# EAGLE design scaler_dual (EAGLE 5.06)
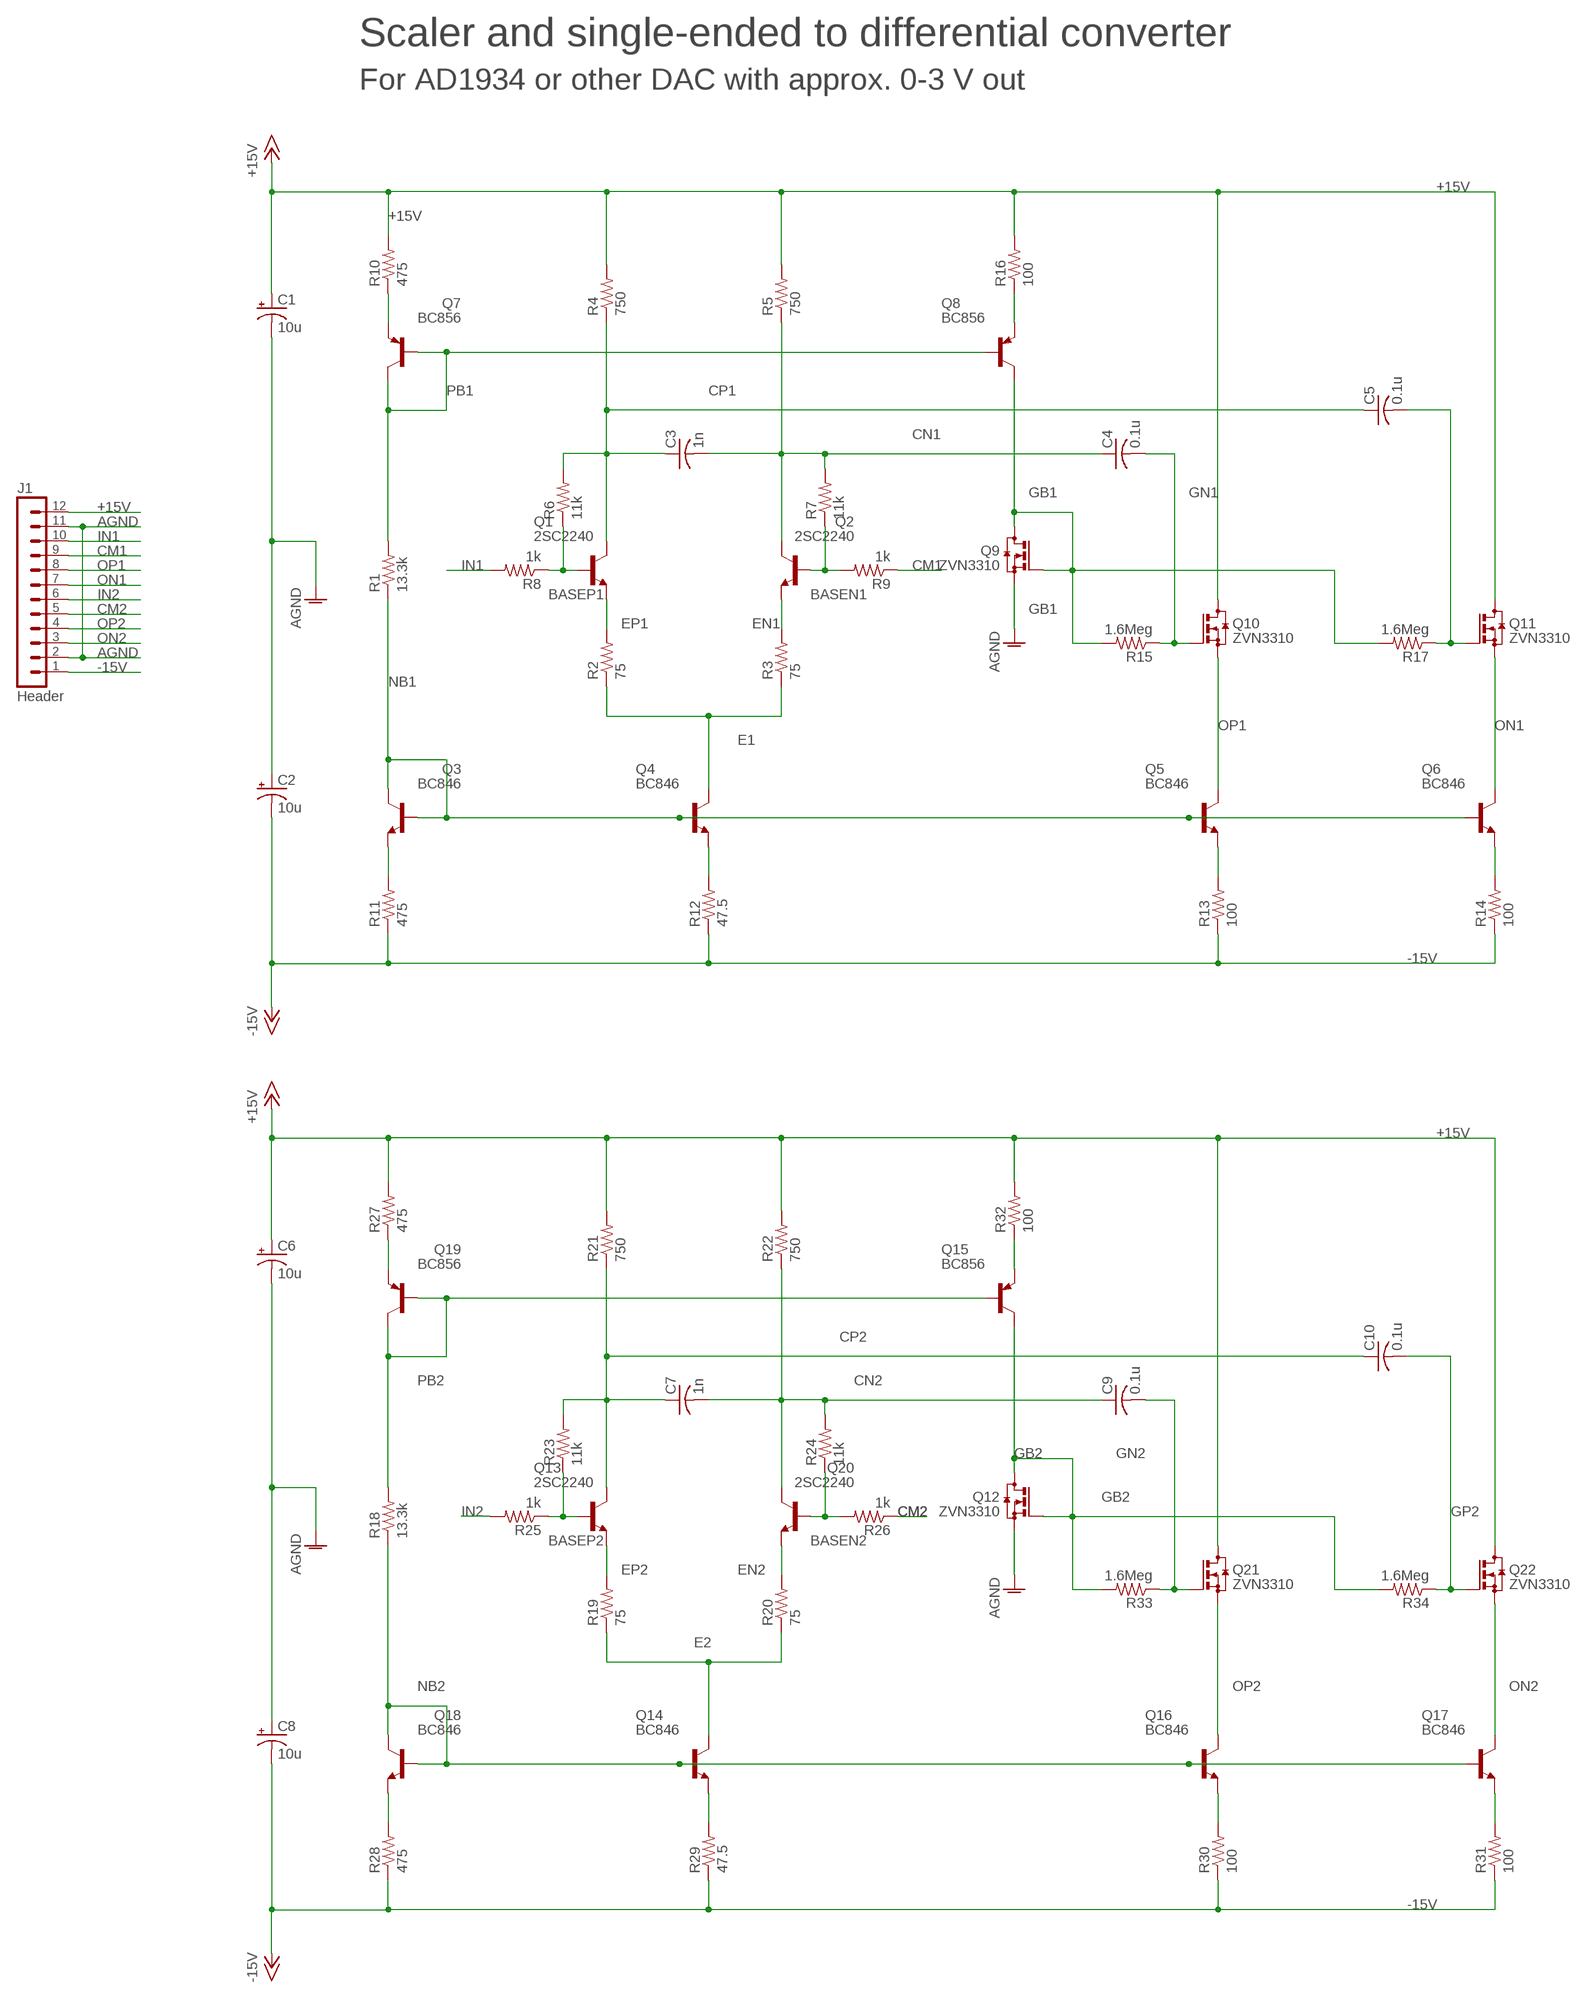
[diagram p0: schematic, sheet 1]

## Parts
C1  10u  CPOL-USC/6032-28R  [C/6032-28R]
C2  10u  CPOL-USC/6032-28R  [C/6032-28R]
C3  1n  C-USC1206  [C1206]
C4  0.1u  C-USC1812  [C1812]
C5  0.1u  C-USC1812  [C1812]
C6  10u  CPOL-USC/6032-28R  [C/6032-28R]
C7  1n  C-USC1206  [C1206]
C8  10u  CPOL-USC/6032-28R  [C/6032-28R]
C9  0.1u  C-USC1812  [C1812]
C10  0.1u  C-USC1812  [C1812]
J1  Header  MA12-1  [MA12-1]
Q1  2SC2240  [TO92-ECB]
Q2  2SC2240  [TO92-ECB]
Q3  BC846  [SOT23]
Q4  BC846  [SOT23]
Q5  BC846  [SOT23]
Q6  BC846  [SOT23]
Q7  BC856  BC856BSMD  [SOT23-BEC]
Q8  BC856  BC856BSMD  [SOT23-BEC]
Q9  ZVN3310  BSS123  [SOT23]
Q10  ZVN3310  BSS123  [SOT23]
Q11  ZVN3310  BSS123  [SOT23]
Q12  ZVN3310  BSS123  [SOT23]
Q13  2SC2240  [TO92-ECB]
Q14  BC846  [SOT23]
Q15  BC856  BC856BSMD  [SOT23-BEC]
Q16  BC846  [SOT23]
Q17  BC846  [SOT23]
Q18  BC846  [SOT23]
Q19  BC856  BC856BSMD  [SOT23-BEC]
Q20  2SC2240  [TO92-ECB]
Q21  ZVN3310  BSS123  [SOT23]
Q22  ZVN3310  BSS123  [SOT23]
R1  13.3k  R-US_R1206  [R1206]
R2  75  R-US_R1206  [R1206]
R3  75  R-US_R1206  [R1206]
R4  750  R-US_R1206  [R1206]
R5  750  R-US_R1206  [R1206]
R6  11k  R-US_R1206  [R1206]
R7  11k  R-US_R1206  [R1206]
R8  1k  R-US_R1206  [R1206]
R9  1k  R-US_R1206  [R1206]
R10  475  R-US_R1206  [R1206]
R11  475  R-US_R1206  [R1206]
R12  47.5  R-US_R1206  [R1206]
R13  100  R-US_R1206  [R1206]
R14  100  R-US_R1206  [R1206]
R15  1.6Meg  R-US_R1206  [R1206]
R16  100  R-US_R1206  [R1206]
R17  1.6Meg  R-US_R1206  [R1206]
R18  13.3k  R-US_R1206  [R1206]
R19  75  R-US_R1206  [R1206]
R20  75  R-US_R1206  [R1206]
R21  750  R-US_R1206  [R1206]
R22  750  R-US_R1206  [R1206]
R23  11k  R-US_R1206  [R1206]
R24  11k  R-US_R1206  [R1206]
R25  1k  R-US_R1206  [R1206]
R26  1k  R-US_R1206  [R1206]
R27  475  R-US_R1206  [R1206]
R28  475  R-US_R1206  [R1206]
R29  47.5  R-US_R1206  [R1206]
R30  100  R-US_R1206  [R1206]
R31  100  R-US_R1206  [R1206]
R32  100  R-US_R1206  [R1206]
R33  1.6Meg  R-US_R1206  [R1206]
R34  1.6Meg  R-US_R1206  [R1206]

## Nets
+15V: C1.+ C6.+ J1.12 Q10.3(D) Q11.3(D) Q21.3(D) Q22.3(D) R4.2 R5.2 R10.2 R16.2 R21.2 R22.2 R27.2 R32.2
-15V: C2.- C8.- J1.1 R11.1 R12.1 R13.1 R14.1 R28.1 R29.1 R30.1 R31.1
AGND: C1.- C2.+ C6.- C8.+ J1.2 J1.11 Q9.2(S) Q12.2(S)
BASEN1: Q2.B R7.1 R9.2
BASEN2: Q20.B R24.1 R26.2
BASEP1: Q1.B R6.1 R8.1
BASEP2: Q13.B R23.1 R25.1
BEA1: Q3.2(E) R11.2
BEA2: Q18.2(E) R28.2
BEB1: Q4.2(E) R12.2
BEB2: Q14.2(E) R29.2
BEC1: Q5.2(E) R13.2
BEC2: Q16.2(E) R30.2
BED1: Q6.2(E) R14.2
BED2: Q17.2(E) R31.2
BEE1: Q7.E R10.1
BEE2: Q19.E R27.1
BEF1: Q8.E R16.1
BEF2: Q15.E R32.1
CM1: J1.9 R9.1
CM2: J1.5 R26.1
CN1: C3.2 C4.1 Q2.C R5.1 R7.2
CN2: C7.2 C9.1 Q20.C R22.1 R24.2
CP1: C3.1 C5.1 Q1.C R4.1 R6.2
CP2: C7.1 C10.1 Q13.C R21.1 R23.2
E1: Q4.3(C) R2.1 R3.1
E2: Q14.3(C) R19.1 R20.1
EN1: Q2.E R3.2
EN2: Q20.E R20.2
EP1: Q1.E R2.2
EP2: Q13.E R19.2
GB1: Q8.C Q9.1(G) Q9.3(D) R15.2 R17.2
GB2: Q12.1(G) Q12.3(D) Q15.C R33.2 R34.2
GN1: C4.2 Q10.1(G) R15.1
GN2: C9.2 Q21.1(G) R33.1
GP1: C5.2 Q11.1(G) R17.1
GP2: C10.2 Q22.1(G) R34.1
IN1: J1.10 R8.2
IN2: J1.6 R25.2
NB1: Q3.1(B) Q3.3(C) Q4.1(B) Q5.1(B) Q6.1(B) R1.1
NB2: Q14.1(B) Q16.1(B) Q17.1(B) Q18.1(B) Q18.3(C) R18.1
ON1: J1.7 Q6.3(C) Q11.2(S)
ON2: J1.3 Q17.3(C) Q22.2(S)
OP1: J1.8 Q5.3(C) Q10.2(S)
OP2: J1.4 Q16.3(C) Q21.2(S)
PB1: Q7.B Q7.C Q8.B R1.2
PB2: Q15.B Q19.B Q19.C R18.2

## Notes on the sheet
- Scaler and single-ended to differential converter
- For AD1934 or other DAC with approx. 0-3 V out

## Library data of the parts
C1 C2 C6 C8 = rcl:CPOL-US: POLARIZED CAPACITOR, American symbol
C3-C5 C7 C9 C10 = rcl:C-US: CAPACITOR, American symbol
J1 = con-lstb:MA12-1: PIN HEADER
Q1 Q2 Q13 Q20 = cdp:2SC2240: NPN Silicon Epitaxial Planar Transistor Source: SEMTECH ELECTRONICS LTD. ... 2SC945 2.pdf
Q3-Q6 Q14 Q16-Q18 = transistor:BC846: NPN TRANSISTOR
Q7 Q8 Q15 Q19 = transistor-pnp:BC856*: PNP Transistror
Q9-Q12 Q21 Q22 = transistor-small-signal:BSS123: N-CHANNEL MOS FET
R1-R34 = rcl:R-US_: RESISTOR, American symbol

## Board
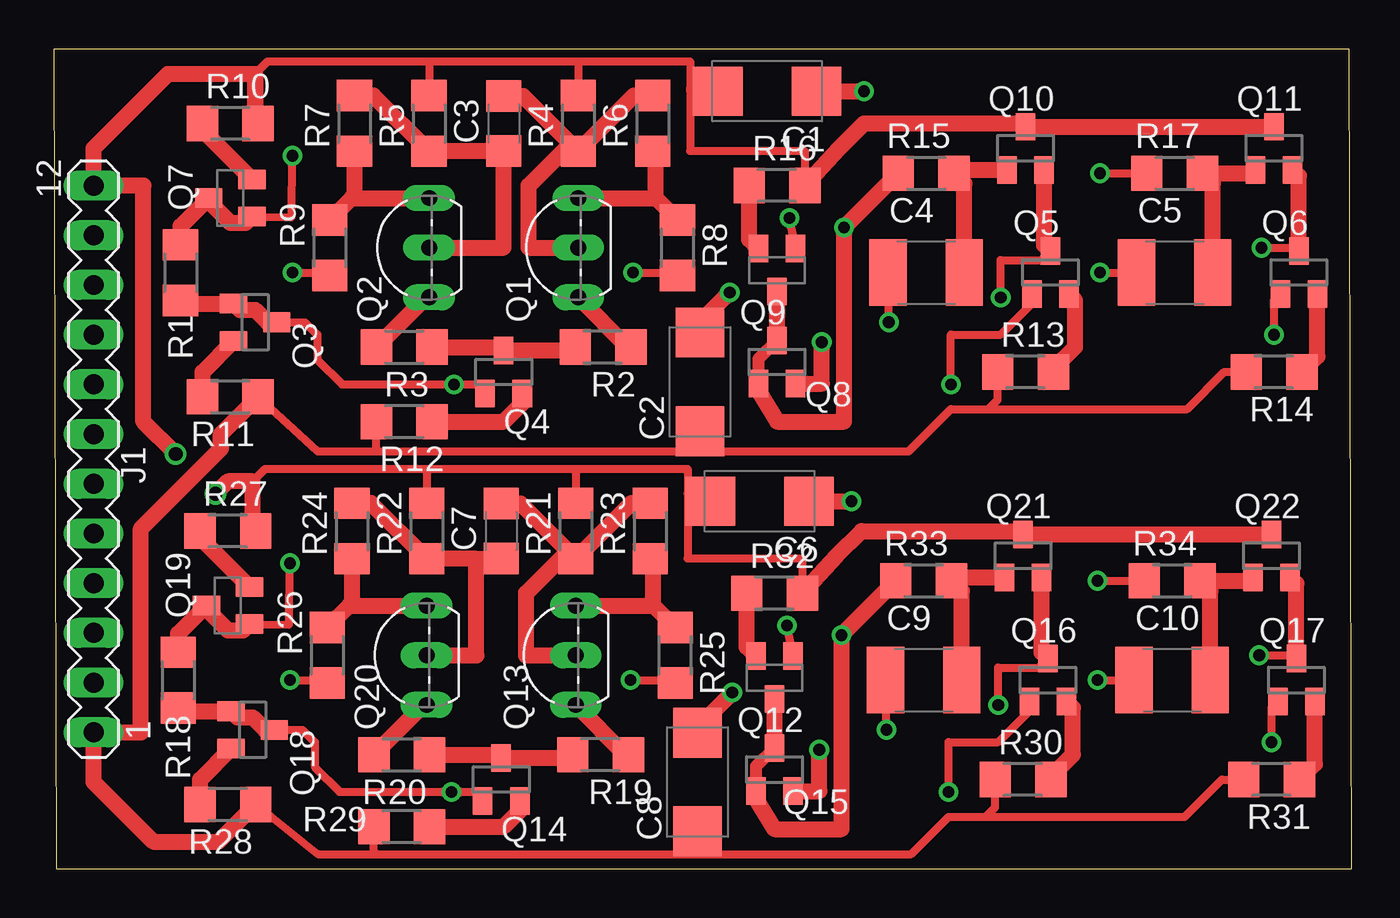
[diagram p1: board, top side]
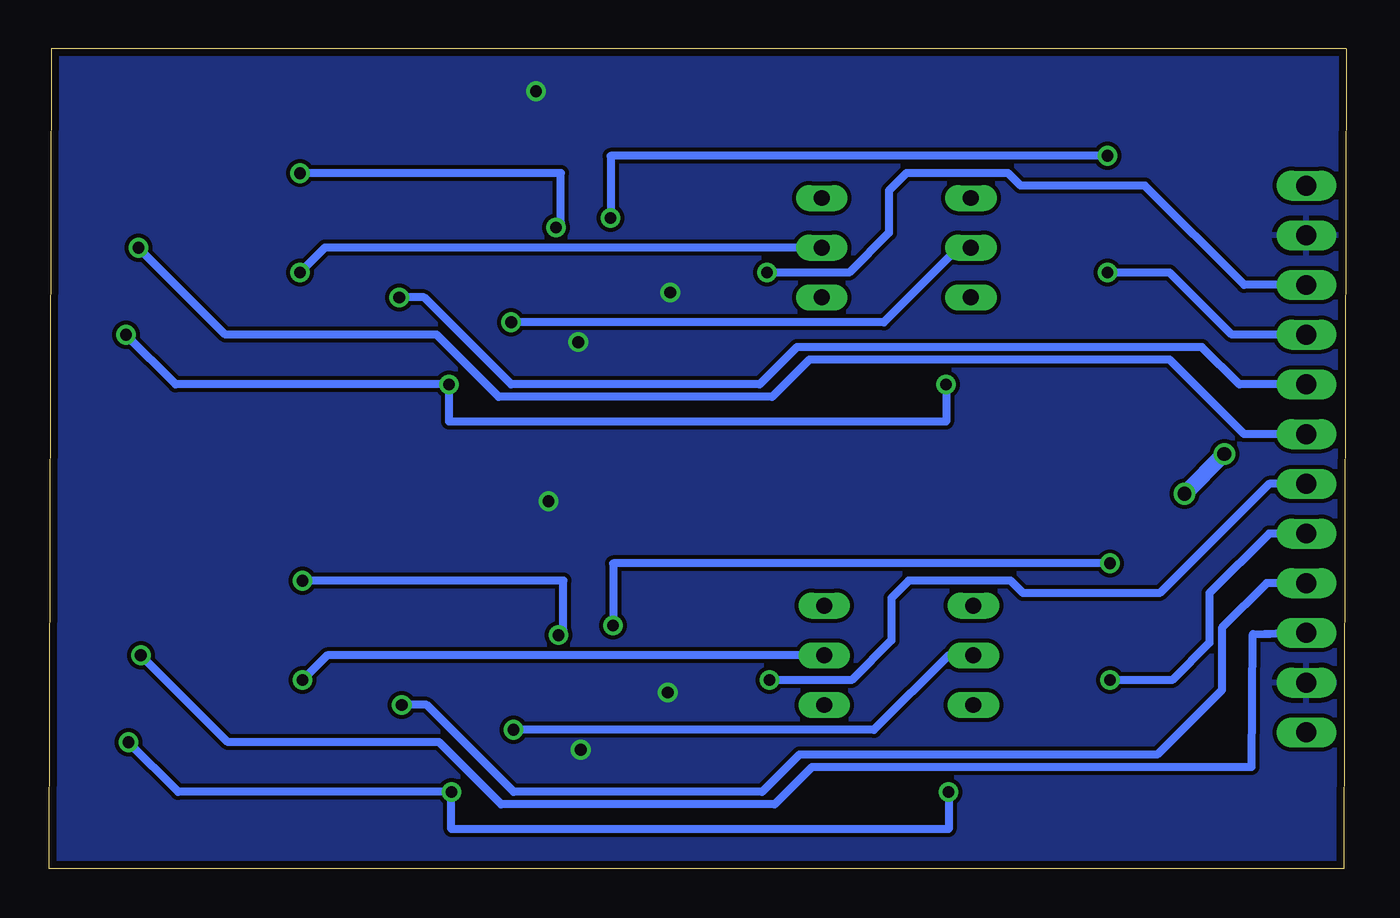
[diagram p2: board, bottom side, seen from below]

Size 66.29 x 41.91 mm. Coordinates in mm from the lower left corner, seen from the top.
Outline: 0.13,0 66.29,0 66.17,41.91 0,41.91 0.13,0
Copper layers (1*16): Top 0.035mm / dielectric 1.5mm / Bottom 0.035mm
Design rules "8mils": minimum track width 10mil, minimum drill 15mil, track to track 8mil, track to pad 8mil, pad to pad 8mil, via to via 8mil, smd to smd 8mil, copper to edge 15mil, drill to drill 8mil, minimum pad ring 10mil, minimum via ring 8mil, stop-mask expansion 4mil, vias tented up to drill 0mil, thermal gap 10mil

### Footprints (pad centres in the part's own frame; a part is rotated, then mirrored left to right if it is on the bottom)
C/6032-28R = smd 2.55 x 2.5: + 2.525,0; - -2.525,0
C1206 = smd 1.6 x 1.8: 1 -1.4,0; 2 1.4,0
C1812 = smd 1.9 x 3.4: 1 -1.95,0; 2 1.95,0
MA12-1 = drill 1.016 long: 1 -13.97,0; 2 -11.43,0; 3 -8.89,0; 4 -6.35,0; 5 -3.81,0; 6 -1.27,0; 7 1.27,0; 8 3.81,0; 9 6.35,0; 10 8.89,0; 11 11.43,0; 12 13.97,0
TO92-ECB = drill 0.813 long: B 2.54,0; C 0,0; E -2.54,0
SOT23 = smd 1 x 1.4: 1 -0.95,-1.1; 2 0.95,-1.1; 3 0,1.1
SOT23-BEC = smd 1 x 1.4: B -0.95,-1.1; C 0,1.1; E 0.95,-1.1
R1206 = smd 1.6 x 1.803: 1 -1.422,0; 2 1.422,0

### Placement (x,y rotation side)
C1  36.45,39.75 180 top
C2  33.02,24.89 90 top
C3  22.99,38.1 270 top
C4  44.58,30.48 0 top
C5  57.28,30.48 0 top
C6  36.07,18.8 180 top
C7  22.86,17.27 270 top
C8  32.89,4.45 90 top
C9  44.45,9.65 0 top
C10  57.15,9.65 0 top
J1  2.03,20.95 90 top
Q1  26.8,31.75 90 top
Q2  19.18,31.75 90 top
Q3  10.29,27.94 270 top
Q4  22.99,25.4 0 top
Q5  50.93,30.48 0 top
Q6  63.63,30.48 0 top
Q7  9.02,34.29 90 top
Q8  36.96,30.61 180 top
Q9  36.96,25.91 0 top
Q10  49.66,36.83 0 top
Q11  62.36,36.83 0 top
Q12  36.83,5.08 0 top
Q13  26.67,10.92 90 top
Q14  22.86,4.57 0 top
Q15  36.83,9.78 180 top
Q16  50.8,9.65 0 top
Q17  63.5,9.65 0 top
Q18  10.16,7.11 270 top
Q19  8.89,13.46 90 top
Q20  19.05,10.92 90 top
Q21  49.53,16 0 top
Q22  62.23,16 0 top
R1  6.48,30.48 90 top
R2  28.07,26.67 0 top
R3  17.91,26.67 180 top
R4  26.8,38.1 90 top
R5  19.18,38.1 90 top
R6  30.61,38.1 90 top
R7  15.37,38.1 90 top
R8  31.88,31.75 270 top
R9  14.1,31.75 90 top
R10  9.02,38.1 0 top
R11  9.02,24.13 180 top
R12  17.91,22.86 0 top
R13  49.66,25.4 0 top
R14  62.36,25.4 0 top
R15  44.58,35.56 180 top
R16  36.96,34.92 0 top
R17  57.28,35.56 180 top
R18  6.35,9.65 90 top
R19  27.94,5.84 0 top
R20  17.78,5.84 180 top
R21  26.67,17.27 90 top
R22  19.05,17.27 90 top
R23  30.48,17.27 90 top
R24  15.24,17.27 90 top
R25  31.75,10.92 270 top
R26  13.97,10.92 90 top
R27  8.89,17.27 0 top
R28  8.89,3.3 180 top
R29  17.78,2.16 0 top
R30  49.53,4.57 0 top
R31  62.23,4.57 0 top
R32  36.83,14.1 0 top
R33  44.45,14.73 180 top
R34  57.15,14.73 180 top

### Tracks (layer width: path | path; a pad name or v marks a point on that pad's centre or on a via)
+15V  (via drill 0.7)
  Top 0.305: 32.39,19.18 33.54,19.18 C6.+
  Top 0.406: R16.2 38.38,36.68 38.23,36.7 32.51,36.7 32.51,39.88 | 32.51,39.88 32.51,41.27 26.8,41.27 | 26.8,41.27 R4.2 | 19.18,41.27 26.8,41.27 | 19.18,41.27 R5.2 | 19.18,41.27 10.92,41.27 10.29,40.64 | R32.2 38.25,15.85 38.1,15.88 32.39,15.88 32.39,19.18 32.39,20.45 26.67,20.45 | 26.67,20.45 R21.2 | 19.05,20.45 26.67,20.45 | 19.05,20.45 R22.2 | 19.05,20.45 10.79,20.45 10.16,19.81 | C1.+ 32.51,39.75 32.51,39.88
  Top 0.813: Q11.3 Q10.3 49.49,38.1 41.4,38.1 40.13,36.83 R16.2 | R5.2 19.18,39.37 | 10.29,40.64 10.22,40.58 10.29,40.51 10.29,38.25 | 10.29,38.25 R10.2 | Q22.3 Q21.3 49.36,17.27 41.28,17.27 40.01,16 R32.2 | R22.2 19.05,18.54 | R27.2 10.16,17.42 10.16,19.68 10.1,19.75 10.16,19.81 8.89,19.81 v8.26,19.18 | 10.29,40.64 10.29,38.25 | 10.29,40.64 5.84,40.64 2.03,36.83 J1.12 4.57,34.92 4.57,22.86 v6.22,21.21
  Bottom 0.813: v8.26,19.18 v6.22,21.21
-15V
  Top 0.305: 33.02,21.46 C2.- | 32.89,0.89 C8.-
  Top 0.406: R14.1 59.82,25.4 57.91,23.5 47.75,23.5 | R13.1 48.23,23.98 47.75,23.5 | 47.75,23.5 45.85,23.5 43.69,21.34 32.89,21.34 | R12.1 16.48,21.36 16.64,21.34 | 32.89,21.34 33.02,21.46 | 16.64,21.34 32.89,21.34 | 16.64,21.34 13.49,21.34 R11.1 | R31.1 59.69,4.57 57.79,2.67 47.62,2.67 | R30.1 48.11,3.15 47.62,2.67 | 47.62,2.67 45.72,2.67 43.82,0.76 32.77,0.76 | R29.1 16.36,0.91 16.51,0.76 | 32.77,0.76 32.89,0.89 | 16.51,0.76 32.77,0.76 | 16.51,0.76 13.49,0.76 R28.1
  Top 0.813: R11.1 8.53,22.23 8.53,21.49 4.44,17.4 4.44,6.99 J1.1 2.03,4.45 5.08,1.4 8.41,1.4 R28.1
AGND  (via drill 0.6)
  Top 0.813: Q9.2 39.24,24.81 v39.24,26.92 | Q12.2 39.12,3.98 v39.12,6.1 | C1.- v41.4,39.75 | C6.- v40.77,18.8 | C2.+ 33.02,27.94 v34.54,29.46 | C8.+ 33.01,6.97 33.01,7.35 v34.67,9.02
  pour Bottom: 0.13,0.25 66.17,0.25 66.04,41.91 0,41.91
BASEN1
  Top 0.813: 15.37,34.29 15.21,34.29 R9.2 | 15.37,34.29 Q2.B | 15.37,34.29 R7.1
BASEN2
  Top 0.813: 15.24,13.46 15.09,13.46 R26.2 | 15.24,13.46 Q20.B | 15.24,13.46 R24.1
BASEP1
  Top 0.813: Q1.B 30.76,34.29 | 30.76,34.29 R8.1 | 30.76,34.29 30.76,36.53 R6.1
BASEP2
  Top 0.813: Q13.B 30.63,13.46 | 30.63,13.46 R25.1 | 30.63,13.46 30.63,15.7 R23.1
BEA1
  Top 0.813: R11.2 7.59,25.4 Q3.2
BEA2
  Top 0.813: R28.2 7.47,4.57 Q18.2
BEB1
  Top 0.813: Q4.2 23.94,23.81 22.99,22.86 R12.2
BEB2
  Top 0.813: Q14.2 23.81,2.98 22.99,2.16 R29.2
BEC1
  Top 0.813: R13.2 51.08,25.55 52.2,26.67 52.2,29.06 Q5.2
BEC2
  Top 0.813: R30.2 50.95,4.72 52.07,5.84 52.07,8.23 Q16.2
BED1
  Top 0.813: Q6.2 64.58,26.2 R14.2
BED2
  Top 0.813: Q17.2 64.45,5.37 R31.2
BEE1
  Top 0.813: R10.1 7.59,37.76 Q7.E
BEE2
  Top 0.813: R27.1 7.47,16.93 Q19.E
BEF1
  Top 0.813: R16.1 35.54,32.18 Q8.E
BEF2
  Top 0.813: R32.1 35.41,11.35 Q15.E
CM1  (via drill 0.6)
  Top 0.406: v12.19,30.48 13.95,30.48 R9.1
  Bottom 0.406: v12.19,30.48 9.02,30.48 5.84,27.3 J1.9
CM2  (via drill 0.6)
  Top 0.406: v12.07,9.65 13.82,9.65 R26.1
  Bottom 0.406: v12.07,9.65 8.89,9.65 6.98,11.56 6.98,14.1 3.94,17.14 J1.5
CN1  (via drill 0.6)
  Top 0.406: v42.67,27.94 42.67,30.43 C4.1
  Top 0.813: Q2.C 22.99,31.75 C3.2 22.96,36.68 R5.1 16.33,39.52 R7.2
  Bottom 0.406: Q2.C 19.81,31.75 23.62,27.94 v42.67,27.94
CN2  (via drill 0.6)
  Top 0.406: C9.1 42.55,9.65 v42.55,7.11
  Top 0.813: R24.2 16.21,18.69 R22.1 21.59,15.85 | C7.2 22.84,15.85 21.59,15.85 | Q20.C 21.59,10.92 21.59,15.85
  Bottom 0.406: v42.55,7.11 24.13,7.11 20.32,10.92 Q20.C
CP1  (via drill 0.6)
  Top 0.406: v53.47,30.48 C5.1 55.37,30.48
  Top 0.813: R6.2 29.64,39.52 R4.1 26.4,37.07 | C3.1 23.97,39.5 26.4,37.07 | Q1.C 24.26,31.75 24.26,34.92 26.4,37.07
  Bottom 0.406: Q1.C 52.2,31.75 v53.47,30.48
CP2  (via drill 0.6)
  Top 0.406: v53.34,9.65 C10.1 55.25,9.65
  Top 0.813: R23.2 29.51,18.69 R21.1 26.28,16.24 | C7.1 23.85,18.67 26.28,16.24 | Q13.C 24.13,10.92 24.13,14.1 26.28,16.24
  Bottom 0.406: Q13.C 52.07,10.92 v53.34,9.65
E1
  Top 0.813: R3.1 22.82,26.67 Q4.3 26.47,26.5 R2.1
E2
  Top 0.813: R20.1 22.69,5.84 Q14.3 26.35,5.67 R19.1
EN1
  Top 0.813: Q2.E 19.02,29.21 R3.2
EN2
  Top 0.813: Q20.E 18.9,8.38 R20.2
EP1
  Top 0.813: R2.2 29.34,26.67 Q1.E
EP2
  Top 0.813: R19.2 29.21,5.84 Q13.E
GB1  (via drill 0.6)
  Top 0.406: v53.47,35.56 R17.2
  Top 0.61: Q9.3 36.01,26.06 Q9.1
  Top 0.813: Q9.3 Q8.C | Q9.1 36.01,24.45 36.96,22.86 40.39,22.86 40.39,32.66 v40.37,32.78 R15.2
  Bottom 0.406: v53.47,35.56 40.13,35.56 40.13,33.02 v40.37,32.78
GB2  (via drill 0.6)
  Top 0.406: v53.34,14.73 R34.2
  Top 0.61: Q12.3 35.88,5.23 Q12.1
  Top 0.813: Q12.3 Q15.C | Q12.1 35.88,3.62 36.83,2.03 40.26,2.03 40.26,11.84 v40.25,11.95 R33.2
  Bottom 0.406: v53.34,14.73 40.01,14.73 40.01,12.19 v40.25,11.95
GN1
  Top 0.813: Q10.1 46.17,35.73 R15.1 46.53,35.03 C4.2
GN2
  Top 0.813: Q21.1 46.04,14.9 R33.1 46.4,14.2 C9.2
GP1
  Top 0.813: Q11.1 61.24,35.56 R17.1 59.23,35.03 C5.2
GP2
  Top 0.813: C10.2 59.1,14.2 R34.1 61.11,14.73 Q22.1
IN1  (via drill 0.6)
  Top 0.406: v29.59,30.48 31.72,30.48 R8.2
  Bottom 0.406: v29.59,30.48 25.4,30.48 23.37,32.51 23.37,34.67 22.48,35.56 17.27,35.56 16.64,34.92 10.29,34.92 5.21,29.84 J1.10
IN2  (via drill 0.6)
  Top 0.406: v29.46,9.65 31.6,9.65 R25.2
  Bottom 0.406: v29.46,9.65 25.27,9.65 23.24,11.68 23.24,13.84 22.35,14.73 17.14,14.73 16.51,14.1 9.53,14.1 3.94,19.68 J1.6
NB1  (via drill 0.6)
  Top 0.406: Q3.3 12.83,27.94 13.46,27.3 13.46,26.04 14.73,24.77 v20.45,24.77 21.57,24.77 Q4.1 | v62.36,27.3 62.36,29.06 Q6.1 | Q5.1 49.98,28.89 48.39,27.3 45.85,27.3 v45.85,24.77
  Top 0.813: Q3.3 10.92,27.94 10.29,28.57 9.5,28.57 Q3.1 6.64,28.89 R1.1
  Bottom 0.406: v20.45,24.77 20.45,22.86 45.85,22.86 v45.85,24.77 59.82,24.77 v62.36,27.3
NB2  (via drill 0.6)
  Top 0.406: Q18.3 12.7,7.11 13.34,6.48 13.34,5.21 14.61,3.94 v20.32,3.94 21.45,3.94 Q14.1 | v62.23,6.48 62.23,8.23 Q17.1 | Q16.1 49.85,8.07 48.26,6.48 45.72,6.48 v45.72,3.94
  Top 0.813: Q18.3 10.79,7.11 10.16,7.75 9.38,7.75 Q18.1 6.52,8.06 R18.1
  Bottom 0.406: v20.32,3.94 20.32,2.03 45.72,2.03 v45.72,3.94 59.69,3.94 v62.23,6.48
ON1  (via drill 0.6)
  Top 0.406: v61.72,31.75 63.46,31.75 Q6.3
  Top 0.813: Q6.3 63.63,35.41 Q11.2
  Bottom 0.406: v61.72,31.75 57.28,27.3 46.48,27.3 43.31,24.13 29.34,24.13 27.43,26.04 9.02,26.04 5.21,22.23 J1.7
ON2  (via drill 0.6)
  Top 0.406: v61.6,10.92 63.33,10.92 Q17.3
  Top 0.813: Q17.3 63.5,14.58 Q22.2
  Bottom 0.406: 4.76,12 4.83,5.21 27.3,5.21 29.21,3.3 43.18,3.3 46.36,6.48 57.15,6.48 v61.6,10.92 | 4.76,12 J1.3 3.05,12.06 4.76,12
OP1  (via drill 0.6)
  Top 0.406: v48.39,29.21 48.39,31.11 50.46,31.11 Q5.3
  Top 0.813: Q10.2 50.61,31.9 Q5.3
  Bottom 0.406: v48.39,29.21 47.12,29.21 42.67,24.77 29.97,24.77 28.07,26.67 7.37,26.67 5.46,24.77 J1.8
OP2  (via drill 0.6)
  Top 0.406: v48.26,8.38 48.26,10.29 50.34,10.29 Q16.3
  Top 0.813: Q21.2 50.48,11.07 Q16.3
  Bottom 0.406: v48.26,8.38 46.99,8.38 42.55,3.94 29.84,3.94 27.94,5.84 9.65,5.84 6.35,9.14 6.35,12.32 4.06,14.61 J1.4
PB1  (via drill 0.6)
  Top 0.406: Q7.C 7.92,34.12 | Q7.B 12.15,33.32 v12.19,36.45 | v37.59,33.27 37.59,33.16 Q8.B
  Top 0.813: R1.2 6.48,32.85 Q7.C | 7.92,34.12 9.02,33.02 9.8,33.02 Q7.B
  Bottom 0.406: v12.19,36.45 37.59,36.45 v37.59,33.27
PB2  (via drill 0.6)
  Top 0.406: Q19.C 7.79,13.29 | Q19.B 12.02,12.49 v12.07,15.62 | v37.47,12.45 37.47,12.34 Q15.B
  Top 0.813: R18.2 6.35,12.02 Q19.C | 7.79,13.29 8.89,12.19 9.67,12.19 Q19.B
  Bottom 0.406: v12.07,15.62 37.47,15.62 v37.47,12.45